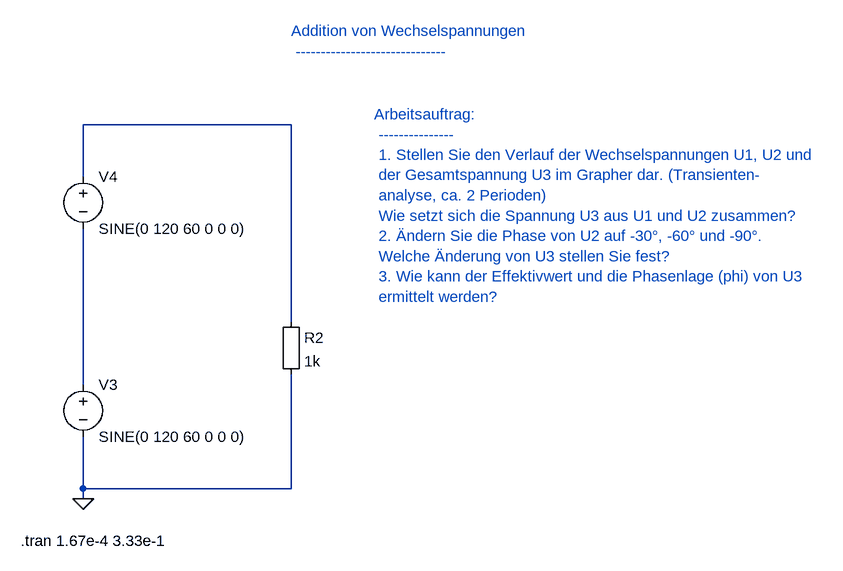
[diagram p0: schematic 10_1_Addition_von_Wechselspannungen.asc]
10_1_Addition_von_Wechselspannungen.asc, the LTspice schematic file:
Version 4
SHEET 1 880 680
WIRE 160 688 160 704
WIRE 160 368 160 384
WIRE 160 704 160 768
WIRE 160 384 160 608
WIRE 160 288 160 208
WIRE 160 208 480 208
WIRE 480 208 480 512
WIRE 160 768 160 784
WIRE 480 592 480 768
WIRE 480 768 160 768
FLAG 160 784 0
SYMBOL voltage 160 592 R0
SYMATTR InstName V3
SYMATTR Value SINE(0 120 60 0 0 0)
SYMBOL voltage 160 272 R0
SYMATTR InstName V4
SYMATTR Value SINE(0 120 60 0 0 0)
SYMBOL Misc\EuropeanResistor 464 496 R0
SYMATTR InstName R2
SYMATTR Value 1k
TEXT 64 848 Left 2 !.tran 1.67e-4 3.33e-1
TEXT 480 64 Left 2 ;Addition von Wechselspannungen \n ------------------------------
TEXT 608 192 Left 2 ;Arbeitsauftrag: \n --------------- \n 1. Stellen Sie den Verlauf der Wechselspannungen U1, U2 und \n der Gesamtspannung U3 im Grapher dar. (Transienten- \n analyse, ca. 2 Perioden) \n Wie setzt sich die Spannung U3 aus U1 und U2 zusammen? \n 2. Ändern Sie die Phase von U2 auf -30°, -60° und -90°. \n Welche Änderung von U3 stellen Sie fest? \n 3. Wie kann der Effektivwert und die Phasenlage (phi) von U3 \n ermittelt werden?

The netlist it stands for:
* 10_1_Addition_von_Wechselspannungen.asc
V3 N001 0 SINE(0 120 60 0 0 0)
V4 N002 N001 SINE(0 120 60 0 0 0)
R2 N002 0 1k
.tran 1.67e-4 3.33e-1
* Addition von Wechselspannungen
*  ------------------------------
* Arbeitsauftrag:
*  ---------------
*  1. Stellen Sie den Verlauf der Wechselspannungen U1, U2 und
*  der Gesamtspannung U3 im Grapher dar. (Transienten-
*  analyse, ca. 2 Perioden)
*  Wie setzt sich die Spannung U3 aus U1 und U2 zusammen?
*  2. Ändern Sie die Phase von U2 auf -30°, -60° und -90°.
*  Welche Änderung von U3 stellen Sie fest?
*  3. Wie kann der Effektivwert und die Phasenlage (phi) von U3
*  ermittelt werden?
.backanno
.end